# Altium project EJ3_Project.PrjPcb
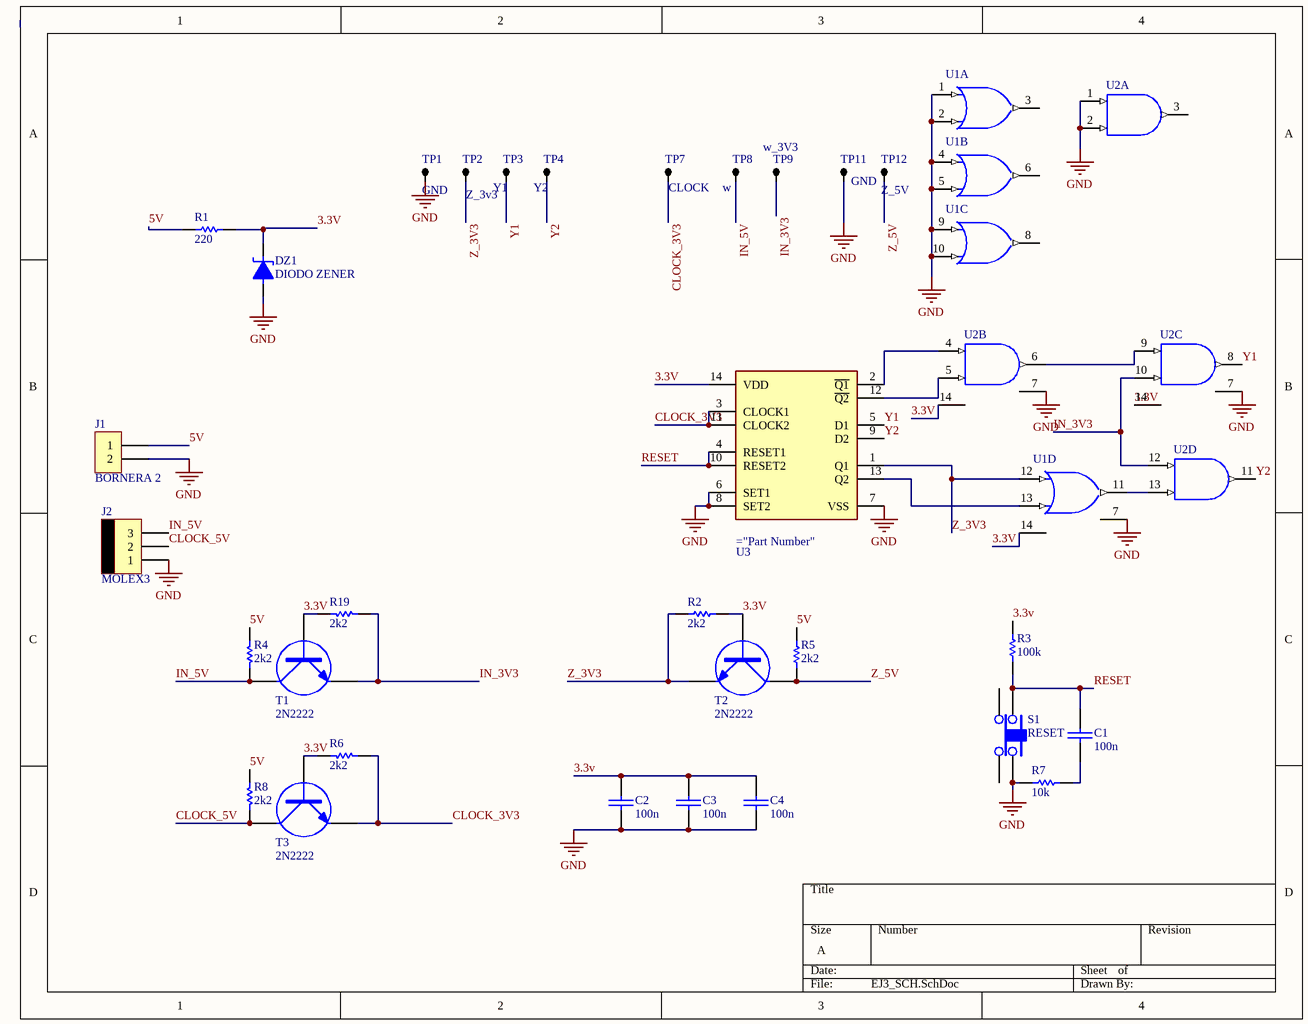
[diagram p0: EJ3_SCH.SchDoc]
1 sheet, 32 parts. Net scope: global (net labels, ports and power ports of the same name join across sheets).
Board file: EJ3_PCB.PcbDoc

## Sheet EJ3_SCH.SchDoc
size A

### Parts
C1  100n  [0805]
C2  100n  [0805]
C3  100n  [0805]
C4  100n  [0805]
DZ1  DIODO ZENER  [DO41]
J1  BORNERA 2  [BORNERA2]
J2  MOLEX3  [MOLEX3]
R1  220  [RES300]
R2  2k2  [0805]
R3  100k  [0805]
R4  2k2  [0805]
R5  2k2  [0805]
R6  2k2  [0805]
R7  10k  [0805]
R8  2k2  [0805]
R19  2k2  [0805]
S1  RESET  [TACTSWITCH]
T1  2N2222  [TO92]
T2  2N2222  [TO92]
T3  2N2222  [TO92]
TP1  GND  [TPTH]
TP2  Z_3v3  [TPTH]
TP3  Y1  [TPTH]
TP4  Y2  [TPTH]
TP7  CLOCK  [TPTH]
TP8  w  [TPTH]
TP9  w_3V3  [TPTH]
TP11  GND  [TPTH]
TP12  Z_5V  [TPTH]
U1  (no value)  [N014]  (parts A,B,C,D of 4)
U2  (no value)  [N014]  (parts A,B,C,D of 4)
U3  CD4013BE  [Texas_Instruments_PDIP14_0]  (value not drawn)

### Nets
3.3V: C2.1 C3.1 C4.1 DZ1.2 R1.2 R2.2 R3.2 R6.2 R19.2 T1.1(B) T2.1(B) T3.1(B) U1.14(VCC) U2.14(VCC) U3.14(VDD)  [also labelled VCC]
GND: C2.2 C3.2 C4.2 DZ1.1 J1.2 J2.1 R7.1 S1.3 TP1.1 TP11.1 U1.1(A) U1.2(B) U1.4(A) U1.5(B) U1.7(GND) U1.9(A) U1.10(B) U2.1(A) U2.2(B) U2.7(GND) U3.6(SET1) U3.7(VSS) U3.8(SET2)
5V: J1.1 R1.1 R4.2 R5.2 R8.2
CLOCK_3V3: R6.1 T3.2(E) TP7.1 U3.3(CLOCK1) U3.11(CLOCK2)
CLOCK_5V: J2.2 R8.1 T3.3(C)
IN_3V3: R19.1 T1.2(E) TP9.1 U2.10(B) U2.12(A)
IN_5V: J2.3 R4.1 T1.3(C) TP8.1
RESET: C1.1 R3.1 S1.1 U3.4(RESET1) U3.10(RESET2)
Y1: TP3.1 U2.8(Y) U3.5(D1)
Y2: TP4.1 U2.11(Y) U3.9(D2)
Z_3V3: R2.1 T2.2(E) TP2.1 U1.12(A) U3.1(Q1)
Z_5V: R5.1 T2.3(C) TP12.1
NetC1_2: C1.2 R7.2
NetU1_11: U1.11(Y) U2.13(B)
NetU1_13: U1.13(B) U3.13(Q2)
NetU2_4: U2.4(A) U3.2(~{Q1})
NetU2_5: U2.5(B) U3.12(~{Q2})
NetU2_6: U2.6(Y) U2.9(A)

Not connected (* = marked no-connect by the designer): S1 2 4; U1 3(Y) 6(Y) 8(Y); U2 3(Y)

### Library data of the parts
C1-C4 = CAP
R1-R8 R19 = RES
S1 = TACT SWITCH
TP1-TP4 TP7-TP9 TP11 TP12 = TP
U1 = SN74HC32N: Quadruple 2-Input Positive-OR Gate; Published: 8-Jun-2000; LatestRevisionDate: 04-Mar-2005; LatestRevisionNote: Stylized 3D Model Added.; DatasheetVersion: May-1997; PackageVersion: Oct-1995; PackageReference: N014; Publisher: Altium Limited; PackageDescription: DIP; 14 Leads; Row Spacing 7.62 mm; Pitch 2.54 mm; ComponentLink1Description: Manufacturer Link; ComponentLink1URL: http://www.ti.com/; ComponentLink2Description: Datasheet; ComponentLink2URL: http://www-s.ti.com/sc/ds/sn74hc32.pdf
U2 = SN74AC08N: Quadruple 2-Input Positive-AND Gate; Published: 8-Jun-2000; LatestRevisionDate: 04-Mar-2005; LatestRevisionNote: Stylized 3D Model Added.; DatasheetVersion: Sep-1996; PackageVersion: Oct-1995; PackageReference: N014; Publisher: Altium Limited; PackageDescription: DIP; 14 Leads; Row Spacing 7.62 mm; Pitch 2.54 mm; ComponentLink1Description: Manufacturer Link; ComponentLink1URL: http://www.ti.com/; ComponentLink2Description: Datasheet; ComponentLink2URL: http://www-s.ti.com/sc/ds/sn74ac08.pdf; ComponentLink3Description: Packaging Specification; ComponentLink3URL: http://focus.ti.com/lit/ml/mpdi002c/mpdi002c.pdf